# EAGLE design daughter (EAGLE 6.3)
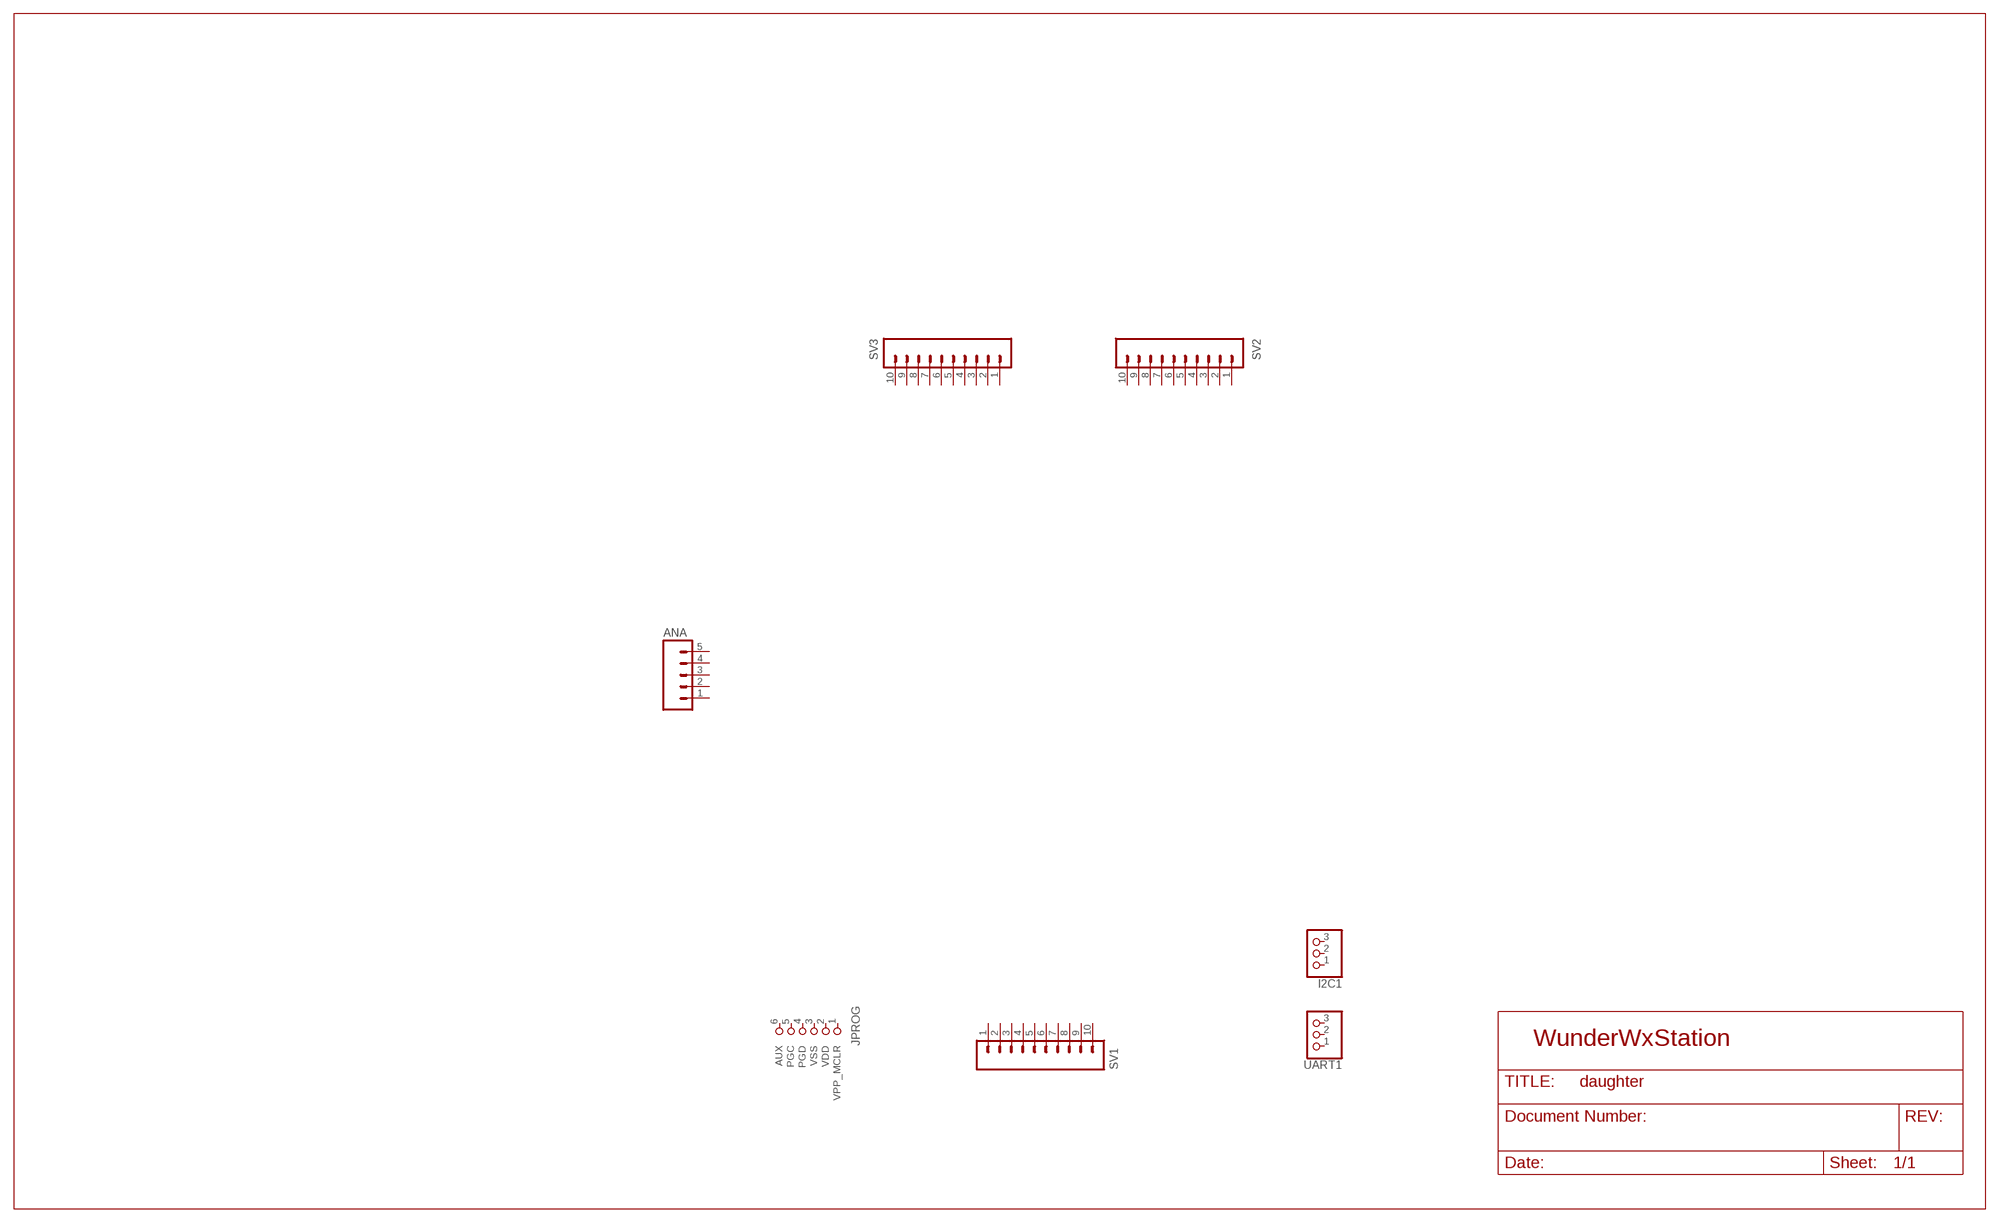
[diagram p0: schematic, sheet 1]

## Parts
ANA  M05PTH  [1X05]
I2C1  PINHD-1X3  [1X03]
JPROG  PIKIT2_PRG  [1X06_PIKIT]
SV1  M10"  [1X10]
SV2  M10"  [1X10]
SV3  M10"  [1X10]
UART1  PINHD-1X3  [1X03]
Unconnected: ANA.1 ANA.2 ANA.3 ANA.4 ANA.5 I2C1.1 I2C1.2 I2C1.3 JPROG.1(VPP_MCLR) JPROG.2(VDD) JPROG.3(VSS) JPROG.4(PGD) JPROG.5(PGC) JPROG.6(AUX) SV1.1 SV1.2 SV1.3 SV1.4 SV1.5 SV1.6 SV1.7 SV1.8 SV1.9 SV1.10 SV2.1 SV2.2 SV2.3 SV2.4 SV2.5 SV2.6 SV2.7 SV2.8 SV2.9 SV2.10 SV3.1 SV3.2 SV3.3 SV3.4 SV3.5 SV3.6 SV3.7 SV3.8 SV3.9 SV3.10 UART1.1 UART1.2 UART1.3

## Notes on the sheet
- WunderWxStation

## Library data of the parts
ANA = wifi_WX:M05: Header 5 Standard 5-pin 0.1" header. Use with straight break away headers (SKU : PRT-00116), right angle break away headers (PRT-00553), swiss pins (PRT-00743), machine pins (PRT-00117), and female headers (PRT-00115). Molex polarized connector foot print use with SKU : PRT-08230 with associated crimp pins and housings.
I2C1 UART1 = wifi_WX:PINHD-1X3: PIN HEADER
JPROG = wifi_WX:PIKIT2_PRG: PIN HEADER
SV1-SV3 = wifi_WX:M10: Header 10 Standard 10-pin 0.1" header. Use with straight break away headers (SKU : PRT-00116), right angle break away headers (PRT-00553), swiss pins (PRT-00743), machine pins (PRT-00117), and female headers (PRT-00115).

## Board
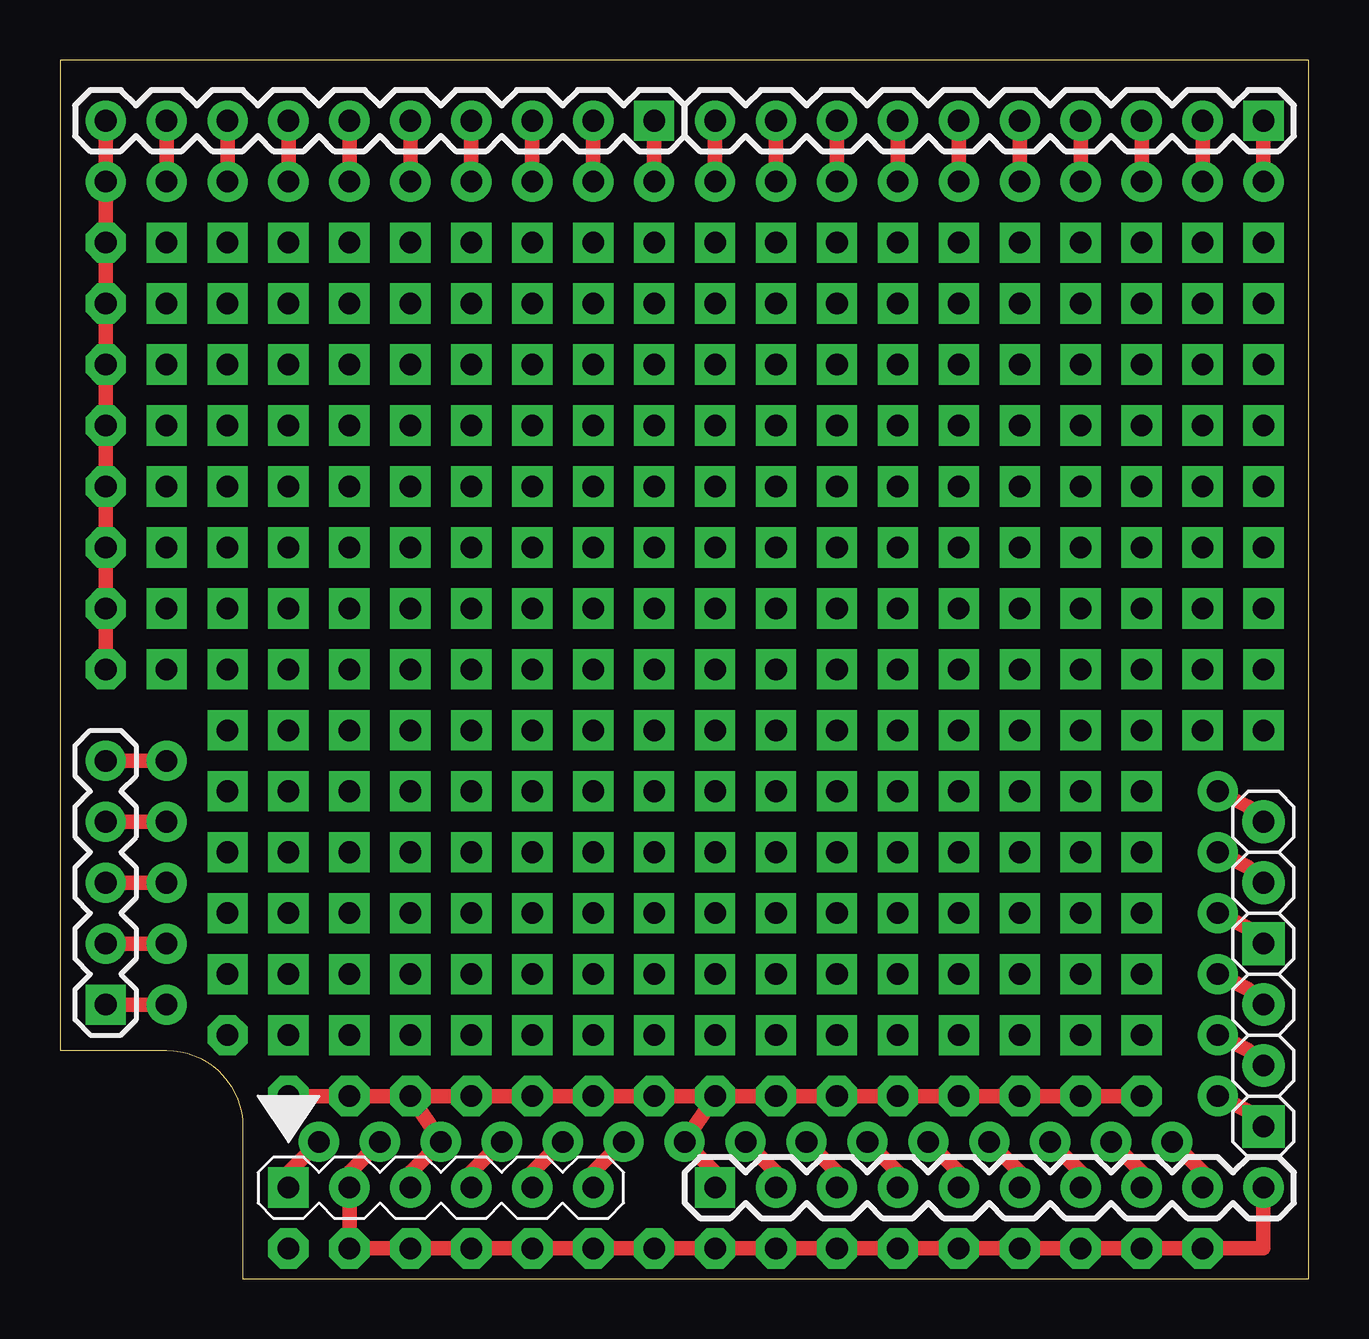
[diagram p1: board, top side]
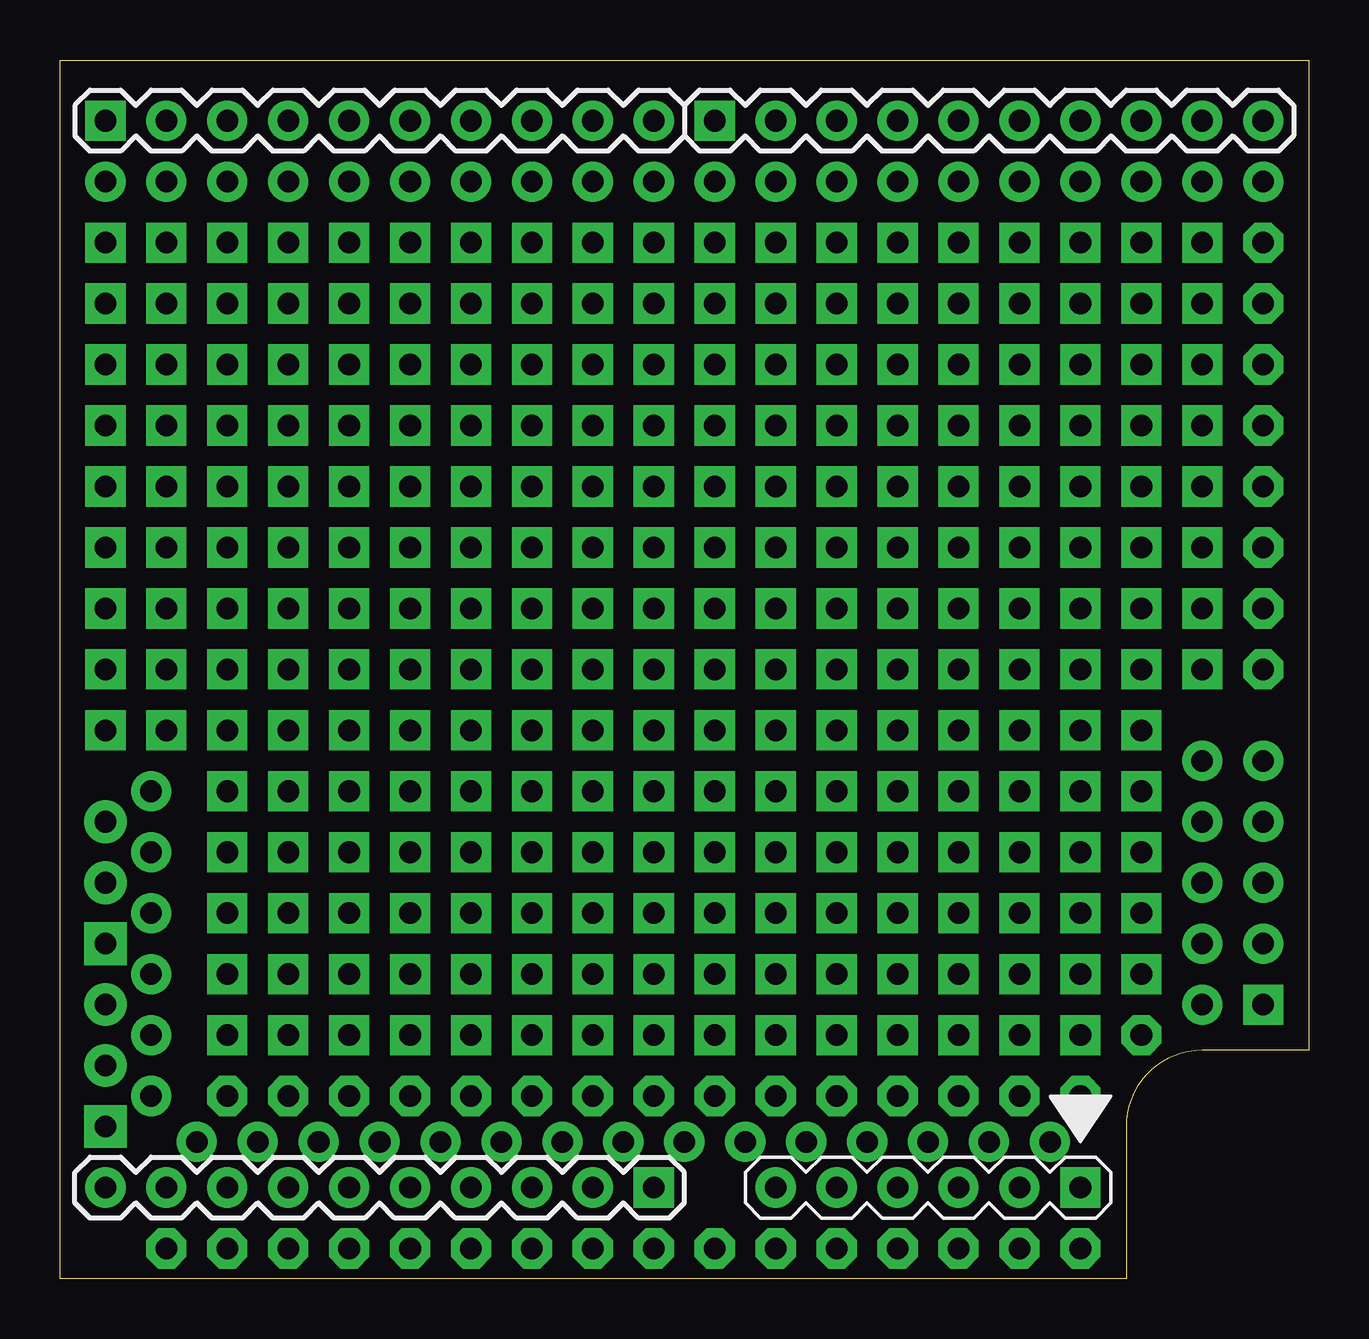
[diagram p2: board, bottom side, seen from below]

Size 52.06 x 50.79 mm. Coordinates in mm from the lower left corner, seen from the top.
Outline: 7.62,0 52.06,0 52.06,50.79 0,50.79 0,9.53 4.45,9.53 arc-90 7.62,6.35 7.62,0
Copper layers (1*16): Top 0.035mm / dielectric 1.5mm / Bottom 0.035mm
Design rules "Elecrow_2-layer_eagle_rule *": minimum track width 6mil, minimum drill 12mil, track to track 6mil, track to pad 6mil, pad to pad 6mil, via to via 6mil, smd to smd 0mil, copper to edge 10mil, drill to drill 10mil, minimum pad ring 10mil, minimum via ring 6mil, stop-mask expansion 2mil, vias tented up to drill 100mil, thermal gap 10mil

### Footprints (pad centres in the part's own frame; a part is rotated, then mirrored left to right if it is on the bottom)
1X05 = drill 0.9 pad 1.676 square: 1 0,0 | drill 0.9 pad 1.676: 2 2.54,0; 3 5.08,0; 4 7.62,0; 5 10.16,0
1X03 = drill 0.9 pad 1.778 square: 1 -2.54,0 | drill 0.9 pad 1.778: 2 0,0; 3 2.54,0
1X06_PIKIT = drill 0.9 pad 1.676 square: 1 -6.35,0 | drill 0.9 pad 1.676: 2 -3.81,0; 3 -1.27,0; 4 1.27,0; 5 3.81,0; 6 6.35,0
1X10 = drill 0.9 pad 1.676 square: 1 0,0 | drill 0.9 pad 1.676: 2 2.54,0; 3 5.08,0; 4 7.62,0; 5 10.16,0; 6 12.7,0; 7 15.24,0; 8 17.78,0; 9 20.32,0; 10 22.86,0

### Placement (x,y rotation side)
ANA  1.91,11.43 90 top
I2C1  50.16,16.51 90 top
JPROG  15.88,3.81 180 bottom
SV1  27.3,3.81 180 bottom
SV2  50.16,48.26 0 bottom
SV3  24.77,48.26 0 bottom
UART1  50.16,8.89 90 top

### Tracks (layer width: path | path; a pad name or v marks a point on that pad's centre or on a via)
N$2  (via drill 0.9 pad 1.68)
  Top 0.61: v4.45,21.59 1.91,21.59
N$3  (via drill 0.9 pad 1.68)
  other vias: 4.45,19.05
N$4  (via drill 0.9 pad 1.68)
  Top 0.61: v4.45,16.51 1.91,16.51
N$5  (via drill 0.9 pad 1.68)
  Top 0.61: v4.45,13.97 1.91,13.97
N$6  (via drill 0.9 pad 1.68)
  Top 0.61: v4.45,11.43 1.91,11.43
N$7  (via drill 0.9 pad 1.68)
  Top 0.61: v13.34,5.71 12.06,4.45
N$8  (via drill 0.9 pad 1.68)
  Top 0.61: v10.8,5.71 9.52,4.45
N$9  (via drill 0.9 pad 1.68)
  Top 0.61: v15.88,5.71 14.6,4.45
N$10  (via drill 0.9 pad 1.68)
  Top 0.61: v18.41,5.71 17.15,4.45
N$11  (via drill 0.9 pad 1.68)
  Top 0.61: v20.95,5.71 19.69,4.45
N$12  (via drill 0.9 pad 1.68)
  other vias: 6.98,25.4
N$13  (via drill 0.9 pad 1.68)
  other vias: 6.98,22.86
N$14  (via drill 0.9 pad 1.68)
  Top 0.61: v23.49,5.71 22.23,4.45
N$15  (via drill 0.9 pad 1.68)
  Top 0.61: v26.04,5.71 27.3,4.45
N$16  (via drill 0.9 pad 1.68)
  Top 0.61: v28.58,5.71 29.84,4.45
N$18  (via drill 0.9 pad 1.68)
  Top 0.61: v31.12,5.71 32.38,4.45
N$19  (via drill 0.9 pad 1.68)
  Top 0.61: v33.66,5.71 34.92,4.45
N$21  (via drill 0.9 pad 1.68)
  Top 0.61: v36.2,5.71 37.46,4.45
N$22  (via drill 0.9 pad 1.68)
  Top 0.61: v38.74,5.71 40.01,4.45
N$23  (via drill 0.9 pad 1.68)
  Top 0.61: v41.27,5.71 42.54,4.45
N$24  (via drill 0.9 pad 1.68)
  Top 0.61: v46.35,5.71 47.63,4.45
N$25  (via drill 0.9 pad 1.68)
  other vias: 9.52,1.27
N$26  (via drill 0.9 pad 1.68)
  Top 0.61: v43.82,5.71 45.09,4.45
N$27  (via drill 0.9 pad 1.68)
  Top 0.61: 49.53,6.99 v48.26,7.62
N$28  (via drill 0.9 pad 1.68)
  Top 0.61: 49.53,9.53 v48.26,10.16
N$29  (via drill 0.9 pad 1.68)
  Top 0.61: 49.53,12.06 v48.26,12.7
N$30  (via drill 0.9 pad 1.68)
  Top 0.61: 49.53,14.61 v48.26,15.24
N$31  (via drill 0.9 pad 1.68)
  Top 0.61: 49.53,17.14 v48.26,17.78
N$32  (via drill 0.9 pad 1.68)
  Top 0.61: 49.53,19.68 v48.26,20.32
N$33  (via drill 0.9 pad 1.68)
  Top 0.61: 1.91,47.62 v1.91,45.72 v1.91,25.4
N$34  (via drill 0.9 pad 1.68)
  Top 0.61: v4.45,45.72 4.45,47.62
N$35  (via drill 0.9 pad 1.68)
  Top 0.61: v6.98,45.72 6.98,47.62
N$36  (via drill 0.9 pad 1.68)
  Top 0.61: v9.52,45.72 9.52,47.62
N$37  (via drill 0.9 pad 1.68)
  Top 0.61: v12.06,45.72 12.06,47.62
N$38  (via drill 0.9 pad 1.68)
  Top 0.61: v14.6,45.72 14.6,47.62
N$39  (via drill 0.9 pad 1.68)
  Top 0.61: v17.15,45.72 17.15,47.62
N$40  (via drill 0.9 pad 1.68)
  Top 0.61: v19.69,45.72 19.69,47.62
N$41  (via drill 0.9 pad 1.68)
  Top 0.61: v22.23,45.72 22.23,47.62
N$42  (via drill 0.9 pad 1.68)
  other vias: 6.98,20.32
N$43  (via drill 0.9 pad 1.68)
  Top 0.61: 12.06,3.17 v12.06,1.27 v14.6,1.27 v17.15,1.27 v19.69,1.27 v22.23,1.27 v24.77,1.27 v27.3,1.27 v29.84,1.27 v32.38,1.27 v34.92,1.27 v37.46,1.27 v40.01,1.27 v42.54,1.27 v45.09,1.27 v47.63,1.27 50.16,1.27 50.16,3.17
N$44  (via drill 0.9 pad 1.68)
  other vias: 1.91,43.18
N$45  (via drill 0.9 pad 1.68)
  other vias: 1.91,40.64
N$46  (via drill 0.9 pad 1.68)
  other vias: 1.91,38.1
N$47
  Top 0.61: 1.91,19.05 4.45,19.05
N$48  (via drill 0.9 pad 1.68)
  other vias: 1.91,35.56
N$49  (via drill 0.9 pad 1.68)
  other vias: 1.91,33.02
N$50  (via drill 0.9 pad 1.68)
  other vias: 1.91,30.48
N$51  (via drill 0.9 pad 1.68)
  other vias: 1.91,27.94
N$54  (via drill 0.9 pad 1.68)
  other vias: 6.98,10.16
N$86  (via drill 0.9 pad 1.68)
  other vias: 6.98,17.78
N$87  (via drill 0.9 pad 1.68)
  Top 0.61: v24.77,45.72 24.77,47.62
N$88  (via drill 0.9 pad 1.68)
  Top 0.61: v27.3,45.72 27.3,47.62
N$89  (via drill 0.9 pad 1.68)
  Top 0.61: v29.84,45.72 29.84,47.62
N$90  (via drill 0.9 pad 1.68)
  Top 0.61: v32.38,45.72 32.38,47.62
N$91  (via drill 0.9 pad 1.68)
  Top 0.61: v34.92,45.72 34.92,47.62
N$92  (via drill 0.9 pad 1.68)
  Top 0.61: v37.46,45.72 37.46,47.62
N$93  (via drill 0.9 pad 1.68)
  Top 0.61: v40.01,45.72 40.01,47.62
N$94  (via drill 0.9 pad 1.68)
  Top 0.61: v42.54,45.72 42.54,47.62
N$95  (via drill 0.9 pad 1.68)
  Top 0.61: v45.09,45.72 45.09,47.62
N$96  (via drill 0.9 pad 1.68)
  Top 0.61: v47.63,45.72 47.63,47.62
N$98  (via drill 0.9 pad 1.68)
  Top 0.61: v50.16,45.72 50.16,47.62
N$101  (via drill 0.9 pad 1.68)
  other vias: 6.98,15.24
N$102  (via drill 0.9 pad 1.68)
  other vias: 6.98,12.7
N$118  (via drill 0.9 pad 1.68)
  other vias: 9.52,25.4
N$133  (via drill 0.9 pad 1.68)
  other vias: 12.06,25.4
N$134  (via drill 0.9 pad 1.68)
  other vias: 14.6,25.4
N$149  (via drill 0.9 pad 1.68)
  other vias: 17.15,25.4
N$150  (via drill 0.9 pad 1.68)
  other vias: 19.69,25.4
N$165  (via drill 0.9 pad 1.68)
  other vias: 22.23,25.4
N$166  (via drill 0.9 pad 1.68)
  other vias: 24.77,25.4
N$181  (via drill 0.9 pad 1.68)
  other vias: 27.3,25.4
N$182  (via drill 0.9 pad 1.68)
  other vias: 29.84,25.4
N$206  (via drill 0.9 pad 1.68)
  other vias: 32.38,25.4
N$207  (via drill 0.9 pad 1.68)
  other vias: 34.92,25.4
N$208  (via drill 0.9 pad 1.68)
  other vias: 37.46,25.4
N$209  (via drill 0.9 pad 1.68)
  other vias: 40.01,25.4
N$210  (via drill 0.9 pad 1.68)
  other vias: 42.54,25.4
N$211  (via drill 0.9 pad 1.68)
  other vias: 45.09,25.4
N$212  (via drill 0.9 pad 1.68)
  other vias: 45.09,22.86
N$213  (via drill 0.9 pad 1.68)
  other vias: 45.09,20.32
N$214  (via drill 0.9 pad 1.68)
  other vias: 45.09,17.78
N$215  (via drill 0.9 pad 1.68)
  other vias: 45.09,15.24
N$216  (via drill 0.9 pad 1.68)
  other vias: 45.09,12.7
N$217  (via drill 0.9 pad 1.68)
  other vias: 45.09,10.16
N$218  (via drill 0.9 pad 1.68)
  Top 0.61: v9.52,7.62 v12.06,7.62 v14.6,7.62 | v14.6,7.62 v17.15,7.62 v19.69,7.62 v22.23,7.62 v24.77,7.62 v27.3,7.62 | v27.3,7.62 v29.84,7.62 v32.38,7.62 v34.92,7.62 v37.46,7.62 v40.01,7.62 v42.54,7.62 v45.09,7.62 | 15.88,5.71 v14.6,7.62 | 26.04,5.71 v27.3,7.62
N$226  (via drill 0.9 pad 1.68)
  other vias: 9.52,22.86
N$227  (via drill 0.9 pad 1.68)
  other vias: 9.52,20.32
N$228  (via drill 0.9 pad 1.68)
  other vias: 9.52,17.78
N$229  (via drill 0.9 pad 1.68)
  other vias: 9.52,15.24
N$230  (via drill 0.9 pad 1.68)
  other vias: 9.52,12.7
N$231  (via drill 0.9 pad 1.68)
  other vias: 9.52,10.16
N$232  (via drill 0.9 pad 1.68)
  other vias: 12.06,22.86
N$233  (via drill 0.9 pad 1.68)
  other vias: 12.06,20.32
N$234  (via drill 0.9 pad 1.68)
  other vias: 12.06,17.78
N$235  (via drill 0.9 pad 1.68)
  other vias: 12.06,15.24
N$236  (via drill 0.9 pad 1.68)
  other vias: 12.06,12.7
N$237  (via drill 0.9 pad 1.68)
  other vias: 12.06,10.16
N$238  (via drill 0.9 pad 1.68)
  other vias: 14.6,22.86
N$239  (via drill 0.9 pad 1.68)
  other vias: 14.6,20.32
N$240  (via drill 0.9 pad 1.68)
  other vias: 14.6,17.78
N$241  (via drill 0.9 pad 1.68)
  other vias: 14.6,15.24
N$242  (via drill 0.9 pad 1.68)
  other vias: 14.6,12.7
N$243  (via drill 0.9 pad 1.68)
  other vias: 14.6,10.16
N$246  (via drill 0.9 pad 1.68)
  other vias: 17.15,22.86
N$247  (via drill 0.9 pad 1.68)
  other vias: 17.15,20.32
N$248  (via drill 0.9 pad 1.68)
  other vias: 17.15,17.78
N$249  (via drill 0.9 pad 1.68)
  other vias: 17.15,15.24
N$250  (via drill 0.9 pad 1.68)
  other vias: 17.15,12.7
N$251  (via drill 0.9 pad 1.68)
  other vias: 17.15,10.16
N$252  (via drill 0.9 pad 1.68)
  other vias: 19.69,22.86
N$253  (via drill 0.9 pad 1.68)
  other vias: 19.69,20.32
N$254  (via drill 0.9 pad 1.68)
  other vias: 19.69,17.78
N$255  (via drill 0.9 pad 1.68)
  other vias: 19.69,15.24
N$256  (via drill 0.9 pad 1.68)
  other vias: 19.69,12.7
N$257  (via drill 0.9 pad 1.68)
  other vias: 19.69,10.16
N$258  (via drill 0.9 pad 1.68)
  other vias: 22.23,10.16
N$259  (via drill 0.9 pad 1.68)
  other vias: 22.23,12.7
N$260  (via drill 0.9 pad 1.68)
  other vias: 22.23,15.24
N$261  (via drill 0.9 pad 1.68)
  other vias: 22.23,17.78
N$262  (via drill 0.9 pad 1.68)
  other vias: 22.23,20.32
N$263  (via drill 0.9 pad 1.68)
  other vias: 22.23,22.86
N$270  (via drill 0.9 pad 1.68)
  other vias: 24.77,22.86
N$271  (via drill 0.9 pad 1.68)
  other vias: 24.77,20.32
N$272  (via drill 0.9 pad 1.68)
  other vias: 24.77,17.78
N$273  (via drill 0.9 pad 1.68)
  other vias: 24.77,15.24
N$274  (via drill 0.9 pad 1.68)
  other vias: 24.77,12.7
N$275  (via drill 0.9 pad 1.68)
  other vias: 24.77,10.16
N$276  (via drill 0.9 pad 1.68)
  other vias: 27.3,22.86
N$277  (via drill 0.9 pad 1.68)
  other vias: 27.3,20.32
N$278  (via drill 0.9 pad 1.68)
  other vias: 27.3,17.78
N$279  (via drill 0.9 pad 1.68)
  other vias: 27.3,15.24
N$280  (via drill 0.9 pad 1.68)
  other vias: 27.3,12.7
N$281  (via drill 0.9 pad 1.68)
  other vias: 27.3,10.16
N$282  (via drill 0.9 pad 1.68)
  other vias: 29.84,22.86
N$283  (via drill 0.9 pad 1.68)
  other vias: 29.84,20.32
N$284  (via drill 0.9 pad 1.68)
  other vias: 29.84,17.78
N$285  (via drill 0.9 pad 1.68)
  other vias: 29.84,15.24
N$286  (via drill 0.9 pad 1.68)
  other vias: 29.84,12.7
N$287  (via drill 0.9 pad 1.68)
  other vias: 29.84,10.16
N$288  (via drill 0.9 pad 1.68)
  other vias: 32.38,22.86
N$289  (via drill 0.9 pad 1.68)
  other vias: 32.38,20.32
N$290  (via drill 0.9 pad 1.68)
  other vias: 32.38,17.78
N$291  (via drill 0.9 pad 1.68)
  other vias: 32.38,15.24
N$292  (via drill 0.9 pad 1.68)
  other vias: 32.38,12.7
N$293  (via drill 0.9 pad 1.68)
  other vias: 32.38,10.16
N$294  (via drill 0.9 pad 1.68)
  other vias: 34.92,22.86
N$295  (via drill 0.9 pad 1.68)
  other vias: 34.92,20.32
N$296  (via drill 0.9 pad 1.68)
  other vias: 34.92,17.78
N$297  (via drill 0.9 pad 1.68)
  other vias: 34.92,15.24
N$298  (via drill 0.9 pad 1.68)
  other vias: 34.92,12.7
N$299  (via drill 0.9 pad 1.68)
  other vias: 34.92,10.16
N$300  (via drill 0.9 pad 1.68)
  other vias: 37.46,10.16
N$301  (via drill 0.9 pad 1.68)
  other vias: 37.46,12.7
N$302  (via drill 0.9 pad 1.68)
  other vias: 37.46,15.24
N$303  (via drill 0.9 pad 1.68)
  other vias: 37.46,17.78
N$304  (via drill 0.9 pad 1.68)
  other vias: 37.46,20.32
N$305  (via drill 0.9 pad 1.68)
  other vias: 37.46,22.86
N$306  (via drill 0.9 pad 1.68)
  other vias: 40.01,22.86
N$307  (via drill 0.9 pad 1.68)
  other vias: 42.54,22.86
N$308  (via drill 0.9 pad 1.68)
  other vias: 40.01,20.32
N$309  (via drill 0.9 pad 1.68)
  other vias: 42.54,20.32
N$310  (via drill 0.9 pad 1.68)
  other vias: 40.01,17.78
N$311  (via drill 0.9 pad 1.68)
  other vias: 42.54,17.78
N$312  (via drill 0.9 pad 1.68)
  other vias: 40.01,15.24
N$313  (via drill 0.9 pad 1.68)
  other vias: 42.54,15.24
N$314  (via drill 0.9 pad 1.68)
  other vias: 40.01,12.7
N$315  (via drill 0.9 pad 1.68)
  other vias: 42.54,12.7
N$316  (via drill 0.9 pad 1.68)
  other vias: 40.01,10.16
N$317  (via drill 0.9 pad 1.68)
  other vias: 42.54,10.16
N$321  (via drill 0.9 pad 1.68)
  other vias: 6.98,43.18
N$322  (via drill 0.9 pad 1.68)
  other vias: 6.98,40.64
N$323  (via drill 0.9 pad 1.68)
  other vias: 6.98,38.1
N$324  (via drill 0.9 pad 1.68)
  other vias: 6.98,35.56
N$325  (via drill 0.9 pad 1.68)
  other vias: 6.98,33.02
N$327  (via drill 0.9 pad 1.68)
  other vias: 6.98,30.48
N$328  (via drill 0.9 pad 1.68)
  other vias: 6.98,27.94
N$329  (via drill 0.9 pad 1.68)
  other vias: 9.52,43.18
N$330  (via drill 0.9 pad 1.68)
  other vias: 12.06,43.18
N$331  (via drill 0.9 pad 1.68)
  other vias: 14.6,43.18
N$332  (via drill 0.9 pad 1.68)
  other vias: 17.15,43.18
N$333  (via drill 0.9 pad 1.68)
  other vias: 19.69,43.18
N$334  (via drill 0.9 pad 1.68)
  other vias: 22.23,43.18
N$335  (via drill 0.9 pad 1.68)
  other vias: 24.77,43.18
N$336  (via drill 0.9 pad 1.68)
  other vias: 27.3,43.18
N$337  (via drill 0.9 pad 1.68)
  other vias: 29.84,43.18
N$338  (via drill 0.9 pad 1.68)
  other vias: 32.38,43.18
N$339  (via drill 0.9 pad 1.68)
  other vias: 34.92,43.18
N$340  (via drill 0.9 pad 1.68)
  other vias: 37.46,43.18
N$341  (via drill 0.9 pad 1.68)
  other vias: 40.01,43.18
N$342  (via drill 0.9 pad 1.68)
  other vias: 42.54,43.18
N$343  (via drill 0.9 pad 1.68)
  other vias: 45.09,43.18
N$344  (via drill 0.9 pad 1.68)
  other vias: 45.09,40.64
N$345  (via drill 0.9 pad 1.68)
  other vias: 45.09,38.1
N$346  (via drill 0.9 pad 1.68)
  other vias: 45.09,35.56
N$347  (via drill 0.9 pad 1.68)
  other vias: 45.09,33.02
N$348  (via drill 0.9 pad 1.68)
  other vias: 45.09,30.48
N$349  (via drill 0.9 pad 1.68)
  other vias: 45.09,27.94
N$350  (via drill 0.9 pad 1.68)
  other vias: 9.52,40.64
N$351  (via drill 0.9 pad 1.68)
  other vias: 9.52,38.1
N$352  (via drill 0.9 pad 1.68)
  other vias: 9.52,35.56
N$353  (via drill 0.9 pad 1.68)
  other vias: 9.52,33.02
N$354  (via drill 0.9 pad 1.68)
  other vias: 9.52,30.48
N$355  (via drill 0.9 pad 1.68)
  other vias: 9.52,27.94
N$356  (via drill 0.9 pad 1.68)
  other vias: 12.06,40.64
N$357  (via drill 0.9 pad 1.68)
  other vias: 12.06,38.1
N$358  (via drill 0.9 pad 1.68)
  other vias: 12.06,35.56
N$359  (via drill 0.9 pad 1.68)
  other vias: 12.06,33.02
N$360  (via drill 0.9 pad 1.68)
  other vias: 12.06,30.48
N$361  (via drill 0.9 pad 1.68)
  other vias: 12.06,27.94
N$362  (via drill 0.9 pad 1.68)
  other vias: 14.6,40.64
N$363  (via drill 0.9 pad 1.68)
  other vias: 14.6,38.1
N$364  (via drill 0.9 pad 1.68)
  other vias: 14.6,35.56
N$365  (via drill 0.9 pad 1.68)
  other vias: 14.6,33.02
N$366  (via drill 0.9 pad 1.68)
  other vias: 14.6,30.48
N$367  (via drill 0.9 pad 1.68)
  other vias: 14.6,27.94
N$368  (via drill 0.9 pad 1.68)
  other vias: 17.15,40.64
N$369  (via drill 0.9 pad 1.68)
  other vias: 17.15,38.1
N$370  (via drill 0.9 pad 1.68)
  other vias: 17.15,35.56
N$371  (via drill 0.9 pad 1.68)
  other vias: 17.15,33.02
N$372  (via drill 0.9 pad 1.68)
  other vias: 17.15,30.48
N$373  (via drill 0.9 pad 1.68)
  other vias: 17.15,27.94
N$374  (via drill 0.9 pad 1.68)
  other vias: 19.69,40.64
N$375  (via drill 0.9 pad 1.68)
  other vias: 19.69,38.1
N$376  (via drill 0.9 pad 1.68)
  other vias: 19.69,35.56
N$377  (via drill 0.9 pad 1.68)
  other vias: 19.69,33.02
N$378  (via drill 0.9 pad 1.68)
  other vias: 19.69,30.48
N$379  (via drill 0.9 pad 1.68)
  other vias: 19.69,27.94
N$380  (via drill 0.9 pad 1.68)
  other vias: 22.23,27.94
N$381  (via drill 0.9 pad 1.68)
  other vias: 22.23,30.48
N$382  (via drill 0.9 pad 1.68)
  other vias: 22.23,33.02
N$383  (via drill 0.9 pad 1.68)
  other vias: 22.23,35.56
N$384  (via drill 0.9 pad 1.68)
  other vias: 22.23,38.1
N$385  (via drill 0.9 pad 1.68)
  other vias: 22.23,40.64
N$386  (via drill 0.9 pad 1.68)
  other vias: 24.77,40.64
N$387  (via drill 0.9 pad 1.68)
  other vias: 24.77,38.1
N$388  (via drill 0.9 pad 1.68)
  other vias: 24.77,35.56
N$389  (via drill 0.9 pad 1.68)
  other vias: 24.77,33.02
N$390  (via drill 0.9 pad 1.68)
  other vias: 24.77,30.48
N$391  (via drill 0.9 pad 1.68)
  other vias: 24.77,27.94
N$392  (via drill 0.9 pad 1.68)
  other vias: 27.3,40.64
N$393  (via drill 0.9 pad 1.68)
  other vias: 27.3,38.1
N$394  (via drill 0.9 pad 1.68)
  other vias: 27.3,35.56
N$395  (via drill 0.9 pad 1.68)
  other vias: 27.3,33.02
N$396  (via drill 0.9 pad 1.68)
  other vias: 27.3,30.48
N$397  (via drill 0.9 pad 1.68)
  other vias: 27.3,27.94
N$398  (via drill 0.9 pad 1.68)
  other vias: 29.84,40.64
N$399  (via drill 0.9 pad 1.68)
  other vias: 29.84,38.1
N$400  (via drill 0.9 pad 1.68)
  other vias: 29.84,35.56
N$401  (via drill 0.9 pad 1.68)
  other vias: 29.84,33.02
N$402  (via drill 0.9 pad 1.68)
  other vias: 29.84,30.48
N$403  (via drill 0.9 pad 1.68)
  other vias: 29.84,27.94
N$404  (via drill 0.9 pad 1.68)
  other vias: 32.38,40.64
N$405  (via drill 0.9 pad 1.68)
  other vias: 32.38,38.1
N$406  (via drill 0.9 pad 1.68)
  other vias: 32.38,35.56
N$407  (via drill 0.9 pad 1.68)
  other vias: 32.38,33.02
N$408  (via drill 0.9 pad 1.68)
  other vias: 32.38,30.48
N$409  (via drill 0.9 pad 1.68)
  other vias: 32.38,27.94
N$410  (via drill 0.9 pad 1.68)
  other vias: 34.92,40.64
N$411  (via drill 0.9 pad 1.68)
  other vias: 34.92,38.1
N$412  (via drill 0.9 pad 1.68)
  other vias: 34.92,35.56
N$413  (via drill 0.9 pad 1.68)
  other vias: 34.92,33.02
N$414  (via drill 0.9 pad 1.68)
  other vias: 34.92,30.48
N$415  (via drill 0.9 pad 1.68)
  other vias: 34.92,27.94
N$416  (via drill 0.9 pad 1.68)
  other vias: 37.46,27.94
N$417  (via drill 0.9 pad 1.68)
  other vias: 37.46,30.48
N$418  (via drill 0.9 pad 1.68)
  other vias: 37.46,33.02
N$419  (via drill 0.9 pad 1.68)
  other vias: 37.46,35.56
N$420  (via drill 0.9 pad 1.68)
  other vias: 37.46,38.1
N$421  (via drill 0.9 pad 1.68)
  other vias: 37.46,40.64
N$422  (via drill 0.9 pad 1.68)
  other vias: 40.01,40.64
N$423  (via drill 0.9 pad 1.68)
  other vias: 42.54,40.64
N$424  (via drill 0.9 pad 1.68)
  other vias: 40.01,38.1
N$425  (via drill 0.9 pad 1.68)
  other vias: 42.54,38.1
N$426  (via drill 0.9 pad 1.68)
  other vias: 40.01,35.56
N$427  (via drill 0.9 pad 1.68)
  other vias: 42.54,35.56
N$428  (via drill 0.9 pad 1.68)
  other vias: 40.01,33.02
N$429  (via drill 0.9 pad 1.68)
  other vias: 42.54,33.02
N$430  (via drill 0.9 pad 1.68)
  other vias: 40.01,30.48
N$431  (via drill 0.9 pad 1.68)
  other vias: 42.54,30.48
N$432  (via drill 0.9 pad 1.68)
  other vias: 40.01,27.94
N$433  (via drill 0.9 pad 1.68)
  other vias: 42.54,27.94
N$435  (via drill 0.9 pad 1.68)
  other vias: 4.45,25.4
N$443  (via drill 0.9 pad 1.68)
  other vias: 4.45,43.18
N$444  (via drill 0.9 pad 1.68)
  other vias: 4.45,40.64
N$445  (via drill 0.9 pad 1.68)
  other vias: 4.45,38.1
N$446  (via drill 0.9 pad 1.68)
  other vias: 4.45,35.56
N$447  (via drill 0.9 pad 1.68)
  other vias: 4.45,33.02
N$448  (via drill 0.9 pad 1.68)
  other vias: 4.45,30.48
N$449  (via drill 0.9 pad 1.68)
  other vias: 4.45,27.94
N$450  (via drill 0.9 pad 1.68)
  other vias: 47.63,25.4
N$451  (via drill 0.9 pad 1.68)
  other vias: 50.16,25.4
N$452  (via drill 0.9 pad 1.68)
  other vias: 50.16,22.86
N$453  (via drill 0.9 pad 1.68)
  other vias: 47.63,22.86
N$454  (via drill 0.9 pad 1.68)
  other vias: 47.63,43.18
N$455  (via drill 0.9 pad 1.68)
  other vias: 50.16,43.18
N$456  (via drill 0.9 pad 1.68)
  other vias: 50.16,40.64
N$457  (via drill 0.9 pad 1.68)
  other vias: 50.16,38.1
N$458  (via drill 0.9 pad 1.68)
  other vias: 50.16,35.56
N$459  (via drill 0.9 pad 1.68)
  other vias: 50.16,33.02
N$460  (via drill 0.9 pad 1.68)
  other vias: 50.16,30.48
N$461  (via drill 0.9 pad 1.68)
  other vias: 50.16,27.94
N$462  (via drill 0.9 pad 1.68)
  other vias: 47.63,40.64
N$463  (via drill 0.9 pad 1.68)
  other vias: 47.63,38.1
N$464  (via drill 0.9 pad 1.68)
  other vias: 47.63,35.56
N$465  (via drill 0.9 pad 1.68)
  other vias: 47.63,33.02
N$466  (via drill 0.9 pad 1.68)
  other vias: 47.63,30.48
N$467  (via drill 0.9 pad 1.68)
  other vias: 47.63,27.94